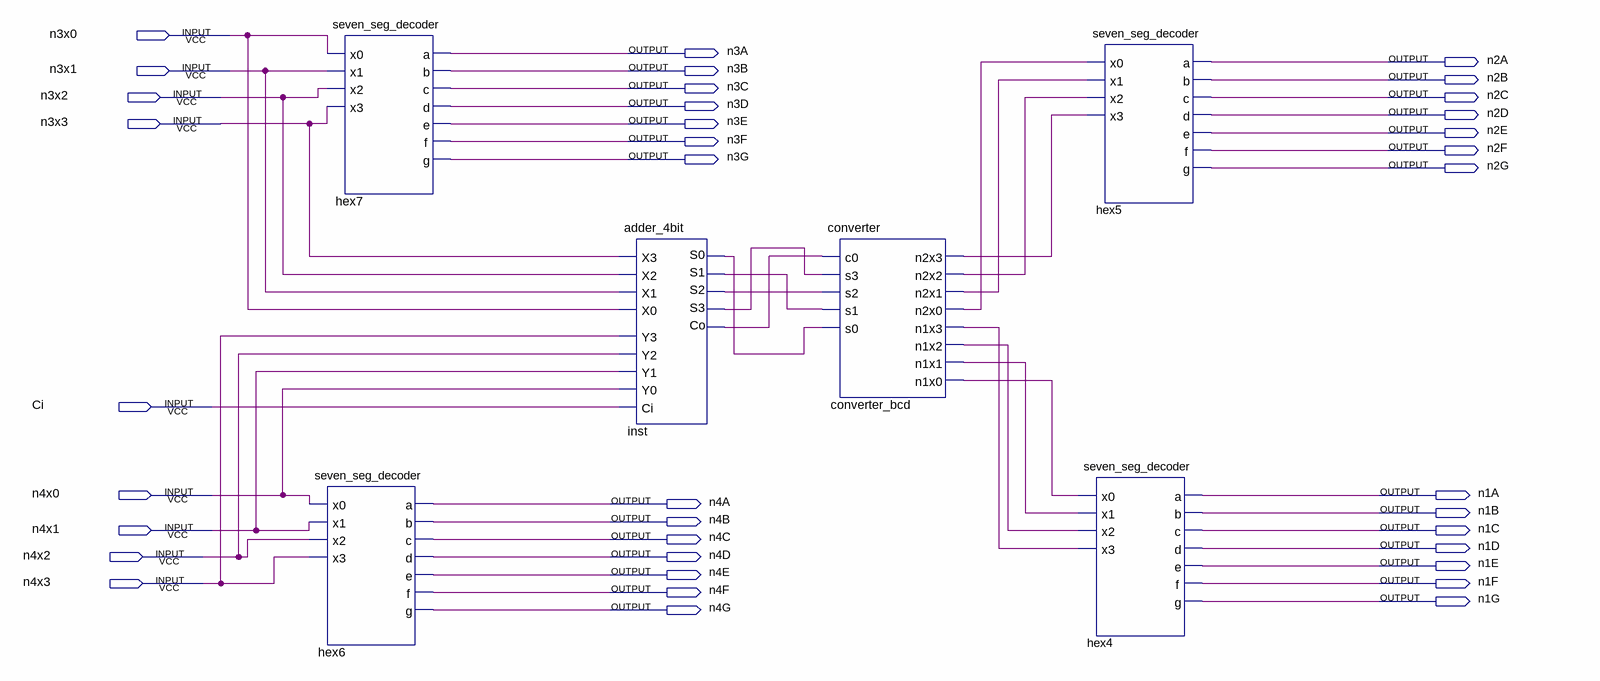
[diagram p0: schematic sheet]
// Quartus schematic Lab06.bdf as structural Verilog: 6 symbols, 37 pins
module Lab06 (
  input  n3x0,
  input  n3x1,
  input  n3x2,
  input  n3x3,
  input  Ci,
  input  n4x0,
  input  n4x1,
  input  n4x2,
  input  n4x3,
  output n3A,
  output n2A,
  output n3B,
  output n2B,
  output n3C,
  output n2C,
  output n3D,
  output n2D,
  output n3E,
  output n2E,
  output n3F,
  output n2F,
  output n3G,
  output n2G,
  output n1A,
  output n4A,
  output n1B,
  output n4B,
  output n1C,
  output n4C,
  output n1D,
  output n4D,
  output n1E,
  output n4E,
  output n1F,
  output n4F,
  output n1G,
  output n4G
);

  wire converter_bcd_n1x0, converter_bcd_n1x1, converter_bcd_n1x2, converter_bcd_n1x3, converter_bcd_n2x0,
       converter_bcd_n2x1, converter_bcd_n2x2, converter_bcd_n2x3, inst_co, inst_s0, inst_s1, inst_s2,
       inst_s3;

  seven_seg_decoder hex7 (
    .x0(n3x0), .x1(n3x1), .x2(n3x2), .x3(n3x3), .a(n3A), .b(n3B), .c(n3C), .d(n3D), .e(n3E), .f(n3F), .g(n3G));
  seven_seg_decoder hex6 (
    .x0(n4x0), .x1(n4x1), .x2(n4x2), .x3(n4x3), .a(n4A), .b(n4B), .c(n4C), .d(n4D), .e(n4E), .f(n4F), .g(n4G));
  adder_4bit inst (
    .X3(n3x3), .Y3(n4x3), .X2(n3x2), .Y2(n4x2), .X1(n3x1), .Y1(n4x1), .X0(n3x0), .Y0(n4x0), .Ci(Ci),
    .S0(inst_s0), .S1(inst_s1), .S2(inst_s2), .S3(inst_s3), .Co(inst_co));
  converter converter_bcd (
    .c0(inst_co), .s3(inst_s3), .s2(inst_s2), .s1(inst_s1), .s0(inst_s0), .n2x3(converter_bcd_n2x3),
    .n2x2(converter_bcd_n2x2), .n2x1(converter_bcd_n2x1), .n2x0(converter_bcd_n2x0),
    .n1x3(converter_bcd_n1x3), .n1x2(converter_bcd_n1x2), .n1x1(converter_bcd_n1x1), .n1x0(converter_bcd_n1x0));
  seven_seg_decoder hex5 (
    .x0(converter_bcd_n2x0), .x1(converter_bcd_n2x1), .x2(converter_bcd_n2x2), .x3(converter_bcd_n2x3),
    .a(n2A), .b(n2B), .c(n2C), .d(n2D), .e(n2E), .f(n2F), .g(n2G));
  seven_seg_decoder hex4 (
    .x0(converter_bcd_n1x0), .x1(converter_bcd_n1x1), .x2(converter_bcd_n1x2), .x3(converter_bcd_n1x3),
    .a(n1A), .b(n1B), .c(n1C), .d(n1D), .e(n1E), .f(n1F), .g(n1G));
endmodule
